# EAGLE design yuniminTopBoard (EAGLE 4.11)
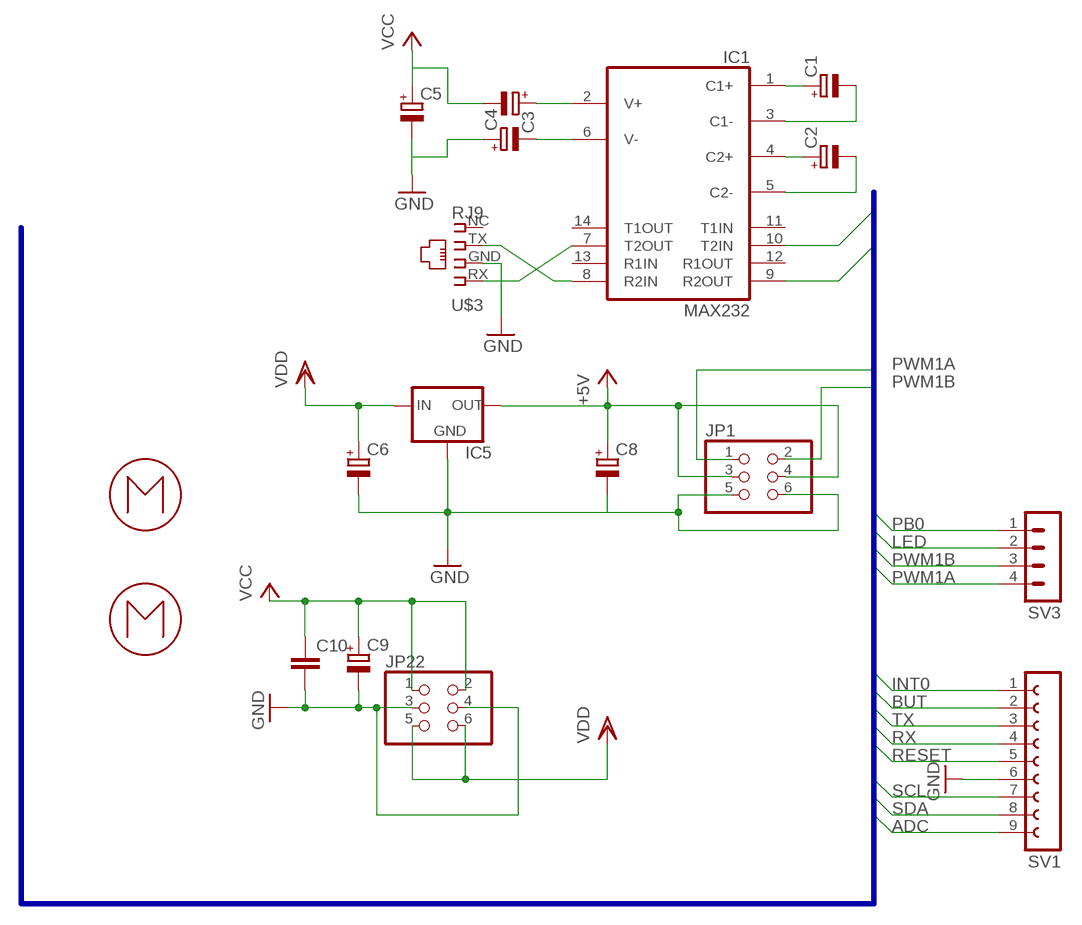
[diagram p0: schematic, sheet 1]

## Parts
C1  CPOL-EUB/3528-21R  [B/3528-21R]
C2  CPOL-EUB/3528-21R  [B/3528-21R]
C3  CPOL-EUB/3528-21R  [B/3528-21R]
C4  CPOL-EUB/3528-21R  [B/3528-21R]
C5  CPOL-EUB/3528-21R  [B/3528-21R]
C6  CPOL-EUE5-10.5  [E5-10,5]
C8  CPOL-EUE5-10.5  [E5-10,5]
C9  CPOL-EUC/6032-28R  [C/6032-28R]
C10  C-EUC1206  [C1206]
IC1  MAX232  [DIL16]
IC5  78XXS  [78XXS]
JP1  PINHD-2X3  [2X03]
JP22  PINHD-2X3  [2X03]
SV1  FE09-1  [FE09]
SV3  MA04-1  [MA04-1]
U$1  MOTORGW8TOP  [GW8L_TOP]
U$2  MOTORGW8TOP  [GW8L_TOP]
U$3  RJ9  [RJ9]

## Nets
+5V: C8.+ IC5.OUT JP1.3 JP1.4
ADC: SV1.9
BUT: SV1.2
GND: C4.+ C5.- C6.- C8.- C9.- C10.2 IC5.GND JP1.5 JP1.6 JP22.3 JP22.4 SV1.6 U$3.GND
INT0: SV1.1
LED: SV3.2
N$1: IC1.7(T2OUT) U$3.RX
N$2: IC1.8(R2IN) U$3.TX
N$3: C3.+ IC1.2(V+)
N$4: C4.- IC1.6(V-)
N$5: C1.+ IC1.1(C1+)
N$6: C1.- IC1.3(C1-)
N$7: C2.+ IC1.4(C2+)
N$8: C2.- IC1.5(C2-)
PB0: SV3.1
PWM1A: JP1.1 SV3.4
PWM1B: JP1.2 SV3.3
RESET: SV1.5
RX: IC1.9(R2OUT) SV1.4
SCL: SV1.7
SDA: SV1.8
TX: IC1.10(T2IN) SV1.3
VCC: C3.- C5.+ C9.+ C10.1 JP22.1 JP22.2
VDD: C6.+ IC5.IN JP22.5 JP22.6
Unconnected: IC1.11(T1IN) IC1.12(R1OUT) IC1.13(R1IN) IC1.14(T1OUT) U$3.NC

## Buses
ADC,BUT,INT0,PB0,LED,PWM1A,PWM1B,RESET,SDA,SCL,RX,TX

## Power pins joined to a net without a drawn wire
GND: IC1.15(GND)
VCC: IC1.16(VCC)

## Library data of the parts
C1-C6 C8 C9 = rcl:CPOL-EU: POLARIZED CAPACITOR, European symbol
C10 = rcl:C-EU: CAPACITOR, European symbol
IC1 = maxim:MAX232: RS232 TRANSEIVER
IC5 = v-reg:78XXS: VOLTAGE REGULATOR
JP1 JP22 = pinhead:PINHD-2X3: PIN HEADER
SV1 = con-lsta:FE09-1: FEMALE HEADER
SV3 = con-lstb:MA04-1: PIN HEADER
U$1 U$2 = motors:MOTORGW8
U$3 = conectors:RJ9

## Board
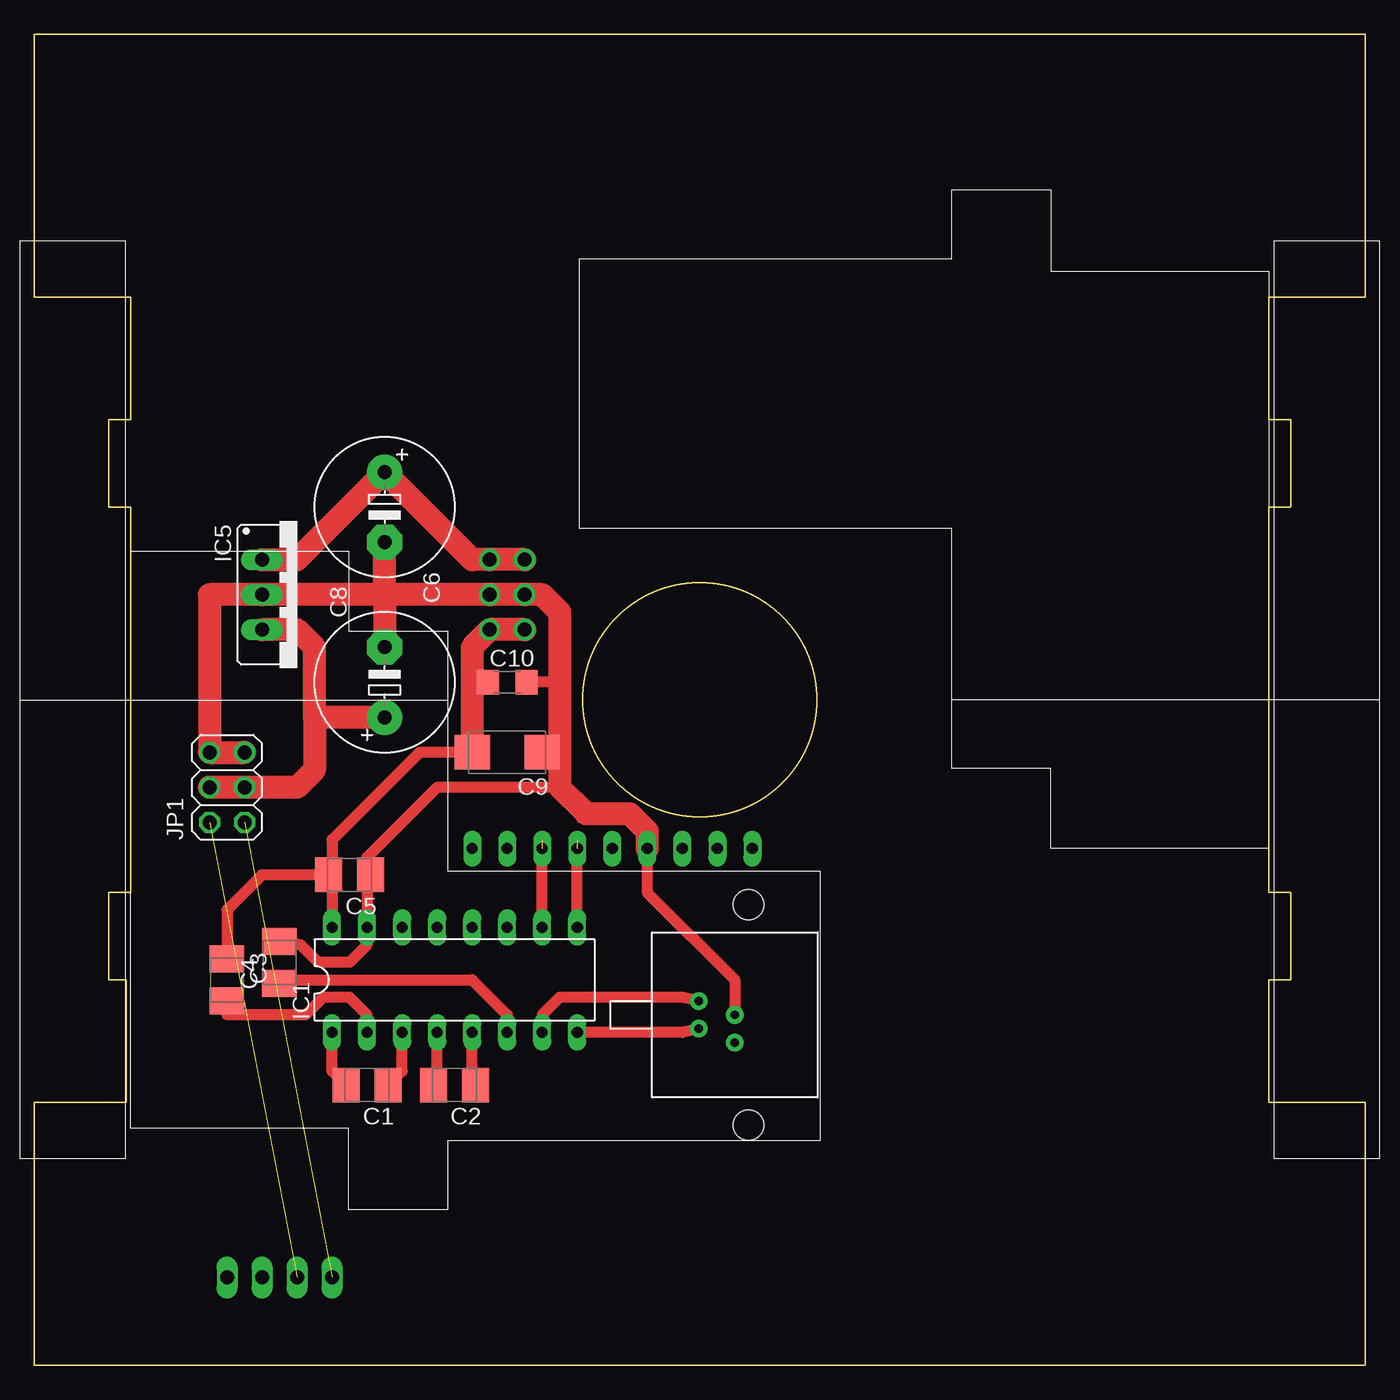
[diagram p1: board, top side]
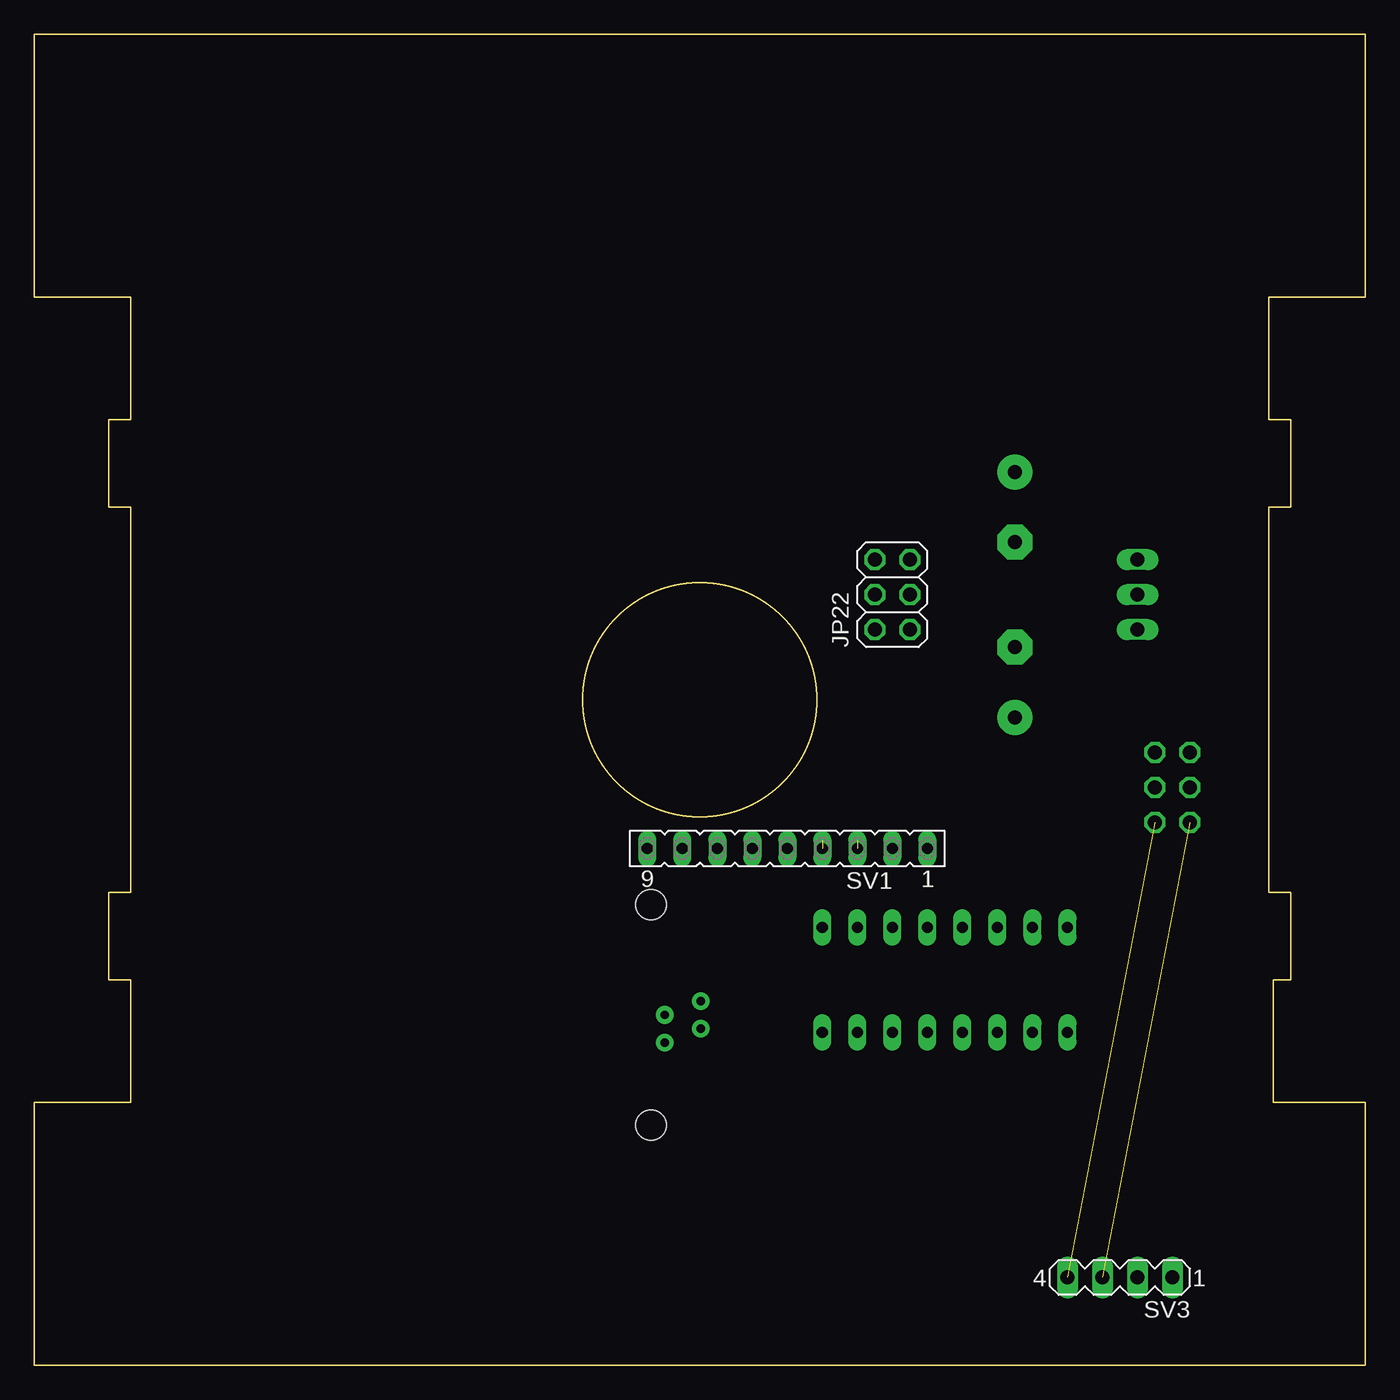
[diagram p2: board, bottom side, seen from below]

Size 96.52 x 96.52 mm. Coordinates in mm from the lower left corner, seen from the top.
Outline: 0,0 96.52,0 96.52,19.05 89.53,19.05 89.53,27.94 91.12,27.94 91.12,34.29 89.53,34.29 89.53,62.23 91.12,62.23 91.12,68.58 89.53,68.58 89.53,77.47 96.52,77.47 96.52,96.52 0,96.52 0,77.47 6.98,77.47 6.98,68.58 5.4,68.58 5.4,62.23 6.98,62.23 6.98,34.29 5.4,34.29 5.4,27.94 6.67,27.94 6.67,19.05 0,19.05 0,0
Outline: circle at 48.26,48.26 radius 8.5
Copper layers (1*16): Top 0.035mm / dielectric 1.5mm / Bottom 0.035mm
Design rules "default": minimum track width 10mil, minimum drill 24mil, track to track 8mil, track to pad 8mil, pad to pad 8mil, via to via 8mil, smd to smd 8mil, copper to edge 40mil, drill to drill 8mil, minimum pad ring 10mil, minimum via ring 8mil, stop-mask expansion 4mil, vias tented up to drill 0mil, thermal gap 10mil

### Footprints (pad centres in the part's own frame; a part is rotated, then mirrored left to right if it is on the bottom)
B/3528-21R = smd 1.95 x 2.5: + 1.525,0; - -1.525,0
E5-10,5 = drill 1.016 pad 2.54 round: + -2.54,0 | drill 1.016 pad 2.54 octagon: - 2.54,0
C/6032-28R = smd 2.55 x 2.5: + 2.525,0; - -2.525,0
C1206 = smd 1.6 x 1.8: 1 -1.4,0; 2 1.4,0
DIL16 = drill 0.813 long: 1 -8.89,-3.81; 2 -6.35,-3.81; 3 -3.81,-3.81; 4 -1.27,-3.81; 5 1.27,-3.81; 6 3.81,-3.81; 7 6.35,-3.81; 8 8.89,-3.81; 9 8.89,3.81; 10 6.35,3.81; 11 3.81,3.81; 12 1.27,3.81; 13 -1.27,3.81; 14 -3.81,3.81; 15 -6.35,3.81; 16 -8.89,3.81
78XXS = drill 1.016 long: GND 0,-2.54; IN -2.54,-2.54; OUT 2.54,-2.54
2X03 = drill 1.016 octagon: 1 -2.54,-1.27; 2 -2.54,1.27; 3 0,-1.27; 4 0,1.27; 5 2.54,-1.27; 6 2.54,1.27
FE09 = drill 0.813 long: 1 -10.16,0; 2 -7.62,0; 3 -5.08,0; 4 -2.54,0; 5 0,0; 6 2.54,0; 7 5.08,0; 8 7.62,0; 9 10.16,0
MA04-1 = drill 1.016 long: 1 -3.81,0; 2 -1.27,0; 3 1.27,0; 4 3.81,0
RJ9 = drill 0.61 pad 1.27 round: GND 0,0; NC 0,2; RX 2.6,-1; TX 2.6,1 | hole 2.2: -1,8; -1,-8

### Placement (x,y rotation side)
C1  24.13,20.32 180 top
C2  30.48,20.32 180 top
C3  13.97,27.94 270 top
C4  17.78,29.21 90 top
C5  22.86,35.56 180 top
C6  25.4,62.23 270 top
C8  25.4,49.53 90 top
C9  34.29,44.45 180 top
C10  34.29,49.53 0 top
IC1  30.48,27.94 0 top
IC5  19.05,55.88 270 top
JP1  13.97,41.91 90 top
JP22  34.29,55.88 90 bottom
SV1  41.91,37.46 180 bottom
SV3  17.78,6.35 180 bottom
U$1  89.53,48.26 90 top
U$2  6.98,48.26 270 top
U$3  50.8,25.4 180 top

### Tracks (layer width: path | path; a pad name or v marks a point on that pad's centre or on a via)
+5V
  Top 1.676: C8.+ 20.32,46.99 | 20.32,46.99 20.32,52.07 19.05,53.34 IC5.OUT | JP1.4 JP1.3 19.05,41.91 20.32,43.18 20.32,46.99
GND
  Top 0.813: C4.+ 19.3,30.48 20.57,29.21 22.86,29.21 24.13,30.48 IC1.15 24.13,35.3 C5.- 24.13,35.81 24.13,36.83 29.21,41.91 38.1,41.91 | U$3.GND 50.8,27.94 44.45,34.29 SV1.6 | 38.1,49.53 C10.2
  Top 1.676: JP1.5 JP1.6 12.7,55.88 IC5.GND 25.4,55.88 | 25.4,55.88 JP22.3 JP22.4 36.83,55.88 38.1,54.61 38.1,49.53 38.1,44.45 | 25.4,55.88 C8.- | 25.4,55.88 C6.- | 36.83,44.45 C9.- 38.1,44.45 | 38.1,44.45 38.1,41.91 40,40 43.18,40 44.45,38.73 SV1.6
N$1
  Top 0.813: IC1.7 36.83,25.4 38.1,26.67 46.99,26.67 U$3.RX
N$2
  Top 0.813: U$3.TX 46.99,24.13 IC1.8
N$3
  Top 0.813: IC1.2 24.13,25.4 22.86,26.67 20.95,26.67 19.68,25.4 13.97,25.4 C3.+ 13.97,26.67
N$4
  Top 0.813: C4.- 18.03,27.94 31.75,27.94 34.29,25.4 IC1.6
N$5
  Top 0.813: C1.+ 21.59,21.33 IC1.1
N$6
  Top 0.813: C1.- 26.67,21.33 IC1.3
N$7
  Top 0.813: C2.+ 29.21,20.57 IC1.4
N$8
  Top 0.813: C2.- 31.75,20.57 IC1.5
PWM1A  (1 unrouted)
PWM1B  (1 unrouted)
RX  (1 unrouted)
  Top 0.813: IC1.9 39.37,38.1
TX  (1 unrouted)
  Top 0.813: IC1.10 36.83,38.1
VCC
  Top 0.813: C5.+ 21.46,35.43 | 21.46,35.43 21.59,35.3 IC1.16 | C3.- 13.97,33.02 16.51,35.56 21.59,35.56 | 21.46,35.43 21.59,35.56 | 31.75,49.53 C10.1 | C9.+ 27.94,44.45 21.59,38.1 21.59,35.56
  Top 1.676: JP22.2 JP22.1 31.75,52.07 31.75,49.53 C9.+
VDD
  Top 1.676: JP22.6 JP22.5 31.75,58.42 C6.+ 19.05,58.42 IC5.IN